# EAGLE design DS2482-LC24XX-breakout (EAGLE 6.3)
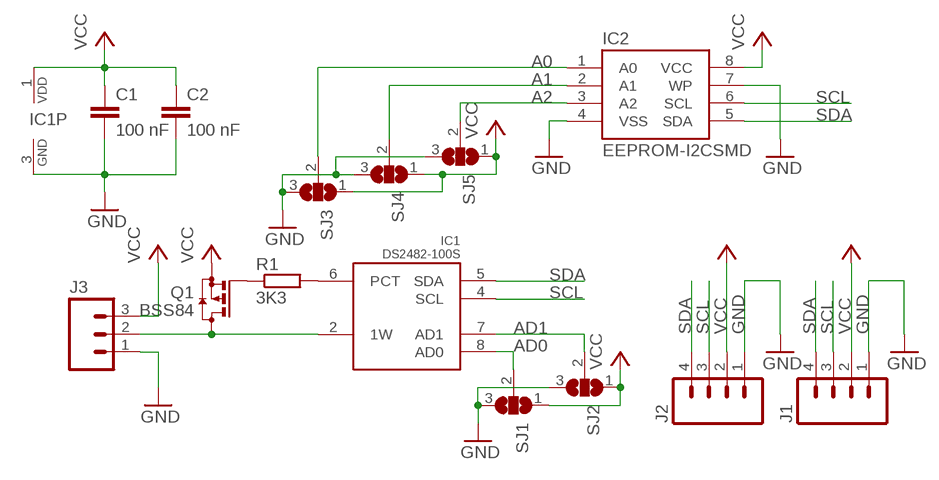
[diagram p0: schematic, sheet 1]

## Parts
C1  100 nF  C-EUC0603  [C0603]
C2  100 nF  C-EUC0603  [C0603]
IC1  DS2482-100S  [SO08]
IC2  EEPROM-I2CSMD  [SO08]
J1  M04PTH  [1X04]
J2  M04PTH  [1X04]
J3  M03PTH  [1X03]
Q1  BSS84  [SOT23]
R1  3K3  R-EU_R0805  [R0805]
SJ1  SJ2W  [SJ_2]
SJ2  SJ2W  [SJ_2]
SJ3  SJ2W  [SJ_2]
SJ4  SJ2W  [SJ_2]
SJ5  SJ2W  [SJ_2]

## Nets
A0: IC2.1(A0) SJ3.2
A1: IC2.2(A1) SJ4.2
A2: IC2.3(A2) SJ5.2
AD0: IC1.8(AD0) SJ1.2
AD1: IC1.7(AD1) SJ2.2
GND: C1.2 C2.2 IC1.3(GND) IC2.4(VSS) IC2.7(WP) J1.1 J2.1 J3.1 SJ1.3 SJ2.3 SJ3.3 SJ4.3 SJ5.3
N$1: IC1.2(1W) J3.2 Q1.3(D)
N$7: IC1.6(PCT) R1.2
N$8: Q1.1(G) R1.1
SCL: IC1.4(SCL) IC2.6(SCL) J1.3 J2.3
SDA: IC1.5(SDA) IC2.5(SDA) J1.4 J2.4
VCC: C1.1 C2.1 IC1.1(VDD) IC2.8(VCC) J1.2 J2.2 J3.3 Q1.2(S) SJ1.1 SJ2.1 SJ3.1 SJ4.1 SJ5.1

## Library data of the parts
C1 C2 = rcl:C-EU: CAPACITOR, European symbol
IC1 = 1wire:DS2482-100: I2C to 1-Wire Host Adapter/Line Driver This device is a onewire host and I2C interface in one chip. It provides the complete DC/AC requirements for onewire communication, including overdrive speed mode, but, unlike the DS2480B chip, no 12V EPROM programming. Notes: For overdrive speed and 5V EEPROM programming, an external active pullup circuit must be connected to the 1W, VDD and PCT pin. See the datasheet for details. The lower two I2C adress bits of the chip can be selected by external pins, so up to 4 chips may be connected to the same I2C bus. Author: Orginal device and description from Giovanni Varasano <giovanni.varasano@fastwebnet.it> Improved by Jan Kandziora <jjj@gmx.de>
IC2 = SparkFun:EEPROM-I2C
J1 J2 = SparkFun:M04: Header 4 Standard 4-pin 0.1" header. Use with straight break away headers (SKU : PRT-00116), right angle break away headers (PRT-00553), swiss pins (PRT-00743), machine pins (PRT-00117), and female headers (PRT-00115). Molex polarized connector foot print use with SKU : PRT-08231 with associated crimp pins and housings. 1MM SMD Version SKU: PRT-10208
J3 = SparkFun:M03: Header 3 Standard 3-pin 0.1" header. Use with straight break away headers (SKU : PRT-00116), right angle break away headers (PRT-00553), swiss pins (PRT-00743), machine pins (PRT-00117), and female headers (PRT-00115). Molex polarized connector foot print use with SKU : PRT-08232 with associated crimp pins and housings.
Q1 = transistor-small-signal:BSS84: P-CHANNEL MOS FET
R1 = rcl:R-EU_: RESISTOR, European symbol
SJ1-SJ5 = jumper:SJ2W: SMD solder JUMPER

## Board
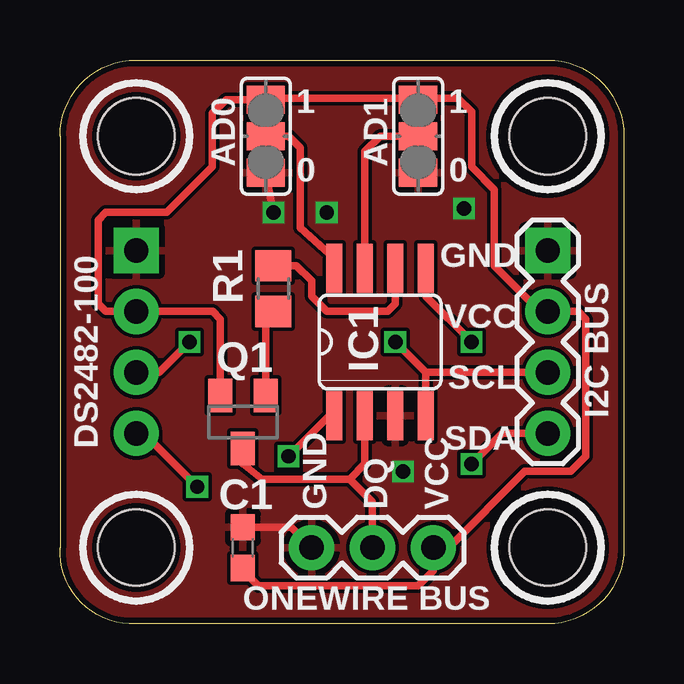
[diagram p1: board, top side]
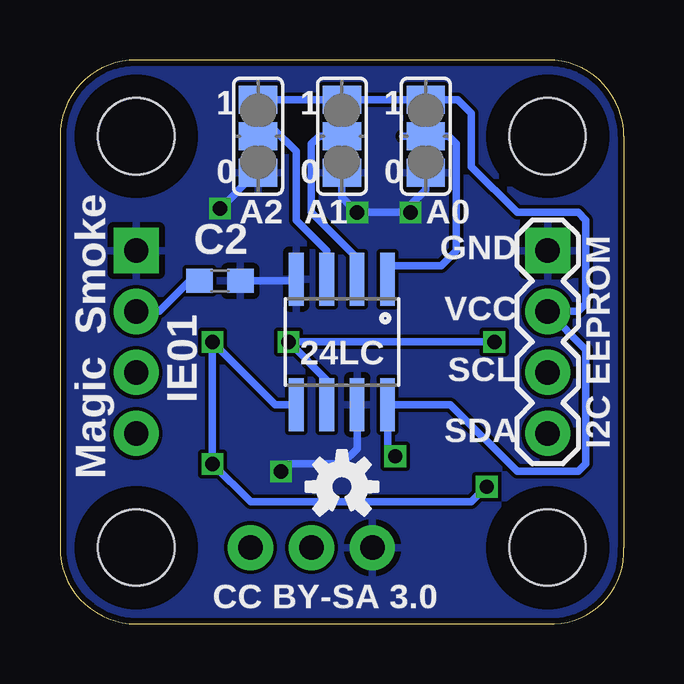
[diagram p2: board, bottom side, seen from below]

Size 23.5 x 23.5 mm. Coordinates in mm from the lower left corner, seen from the top.
Outline: 20.32,23.5 arc-90 23.5,20.32 23.5,3.18 arc-90 20.32,0 3.18,0 arc-96 0,3.18 0,20.32 arc-90 3.18,23.5 20.32,23.5
Copper layers (1*2*15*16): Top 0.035mm / dielectric 0.2mm / layer 2 0.0175mm / dielectric 1.1mm / layer 15 0.0175mm / dielectric 0.2mm / Bottom 0.035mm
Design rules "SeeedStudio_DRU_no_angle_20130527": minimum track width 6mil, minimum drill 12mil, track to track 6mil, track to pad 6mil, pad to pad 6mil, via to via 6mil, smd to smd 0mil, copper to edge 10mil, drill to drill 10mil, minimum pad ring 6mil, minimum via ring 6mil, stop-mask expansion 2mil, vias tented up to drill 25mil, thermal gap 10mil
Holes 3.17 mm at 20.32,3.18 20.32,20.32 3.18,3.18 3.18,20.32
tRestrict: area 17.8,17.8 to 22.9,22.9; area 17.8,0.6 to 22.9,5.7
bRestrict: area 17.8,17.8 to 22.9,22.9; area 17.8,0.6 to 22.9,5.7; area 0.6,0.6 to 5.7,5.7; area 0.6,17.8 to 5.7,22.9

### Footprints (pad centres in the part's own frame; a part is rotated, then mirrored left to right if it is on the bottom)
C0603 = smd 1.1 x 1: 1 -0.85,0; 2 0.85,0
SO08 = smd 0.66 x 2.032: 1 -1.905,-3.073; 2 -0.635,-3.073; 3 0.635,-3.073; 4 1.905,-3.073; 5 1.905,3.073; 6 0.635,3.073; 7 -0.635,3.073; 8 -1.905,3.073
SO08' = smd 0.61 x 2.21: 1 -1.905,-2.616; 2 -0.635,-2.616; 3 0.635,-2.616; 4 1.905,-2.616; 5 1.905,2.616; 6 0.635,2.616; 7 -0.635,2.616; 8 -1.905,2.616
1X04 = drill 1.016 pad 1.88 square: 1 0,0 | drill 1.016 pad 1.88: 2 2.54,0; 3 5.08,0; 4 7.62,0
1X03 = drill 1.016 pad 1.88: 1 0,0; 2 2.54,0; 3 5.08,0
SOT23 = smd 1 x 1.4: 1 -0.95,-1.1; 2 0.95,-1.1; 3 0,1.1
R0805 = smd 1.3 x 1.5: 1 -0.95,0; 2 0.95,0
SJ_2 = smd 1.168 x 1.6: 1 -1.524,0; 2 0,0; 3 1.524,0

### Placement (x,y rotation side)
C1  7.62,3.18 90 top
C2  16.83,14.29 0 bottom
IC1  13.34,11.75 0 top
IC2  EEPROM-I2CSMD  [SO08']  11.75,11.75 180 bottom
J1  20.32,15.56 270 top
J2  3.18,15.56 270 bottom
J3  10.48,3.18 0 top
Q1  7.62,8.42 180 top
R1  8.89,13.97 90 top
SJ1  8.57,20.32 270 top
SJ2  14.92,20.32 270 top
SJ3  8.26,20.32 270 bottom
SJ4  11.75,20.32 270 bottom
SJ5  15.24,20.32 270 bottom
U$3  [OSHW-LOGO-S]  11.75,5.72 0 bottom

### Tracks (layer width: path | path; a pad name or v marks a point on that pad's centre or on a via)
A0
  Bottom 0.305: 9.21,20.32 SJ3.2 7.3,20.32 6.99,20 6.99,15.56 7.62,14.92 9.84,14.92 IC2.1
A1
  Bottom 0.305: SJ4.2 12.7,20.32 13.02,20 13.02,17.15 11.11,15.24 IC2.2
A2
  Bottom 0.305: IC2.3 12.38,15.56 13.65,16.83 13.65,19.69 14.61,20.64 15.24,20.64 SJ5.2
AD0
  Top 0.305: SJ1.2 9.53,20.32 10,19.85 10,16.51 11.43,15.24 IC1.8
AD1
  Top 0.305: SJ2.2 13.34,20.32 12.7,19.69 IC1.7
GND  (via drill 0.6)
  Top 0.305: C1.2 9.63,4.03 J3.1 | SJ1.3 v8.89,17.15
  Bottom 0.305: C2.2 13.73,14.29 IC2.4 | IC2.7 11.11,7.3 11.75,6.67 13.97,6.67 v14.29,6.35 | SJ4.3 11.75,17.78 v11.11,17.15 9.21,17.15 9.05,17.31 | SJ3.3 8.26,18.1 9.05,17.31 | SJ5.3 15.4,18.73 v16.83,17.31 | v8.89,17.15 9.05,17.31
  pour Top: -0.63,24.13 24.13,24.13 24.13,-0.63 -0.63,-0.63
  pour Bottom: -0.95,-0.95 -0.95,24.45 24.45,24.45 24.45,-0.95
N$1
  Top 0.305: IC1.2 12.7,6.67 12.07,6.03 | 12.07,6.03 13.02,5.08 J3.2 | 12.07,6.03 8.43,6.03 7.62,6.67 Q1.3
N$7
  Top 0.305: IC1.6 13.97,13.34 13.65,13.02 11.11,13.02 10.48,13.65 10.48,14.29 9.84,14.92 R1.2
N$8
  Top 0.305: Q1.1 8.57,12.7 R1.1
SCL  (via drill 0.6)
  Top 0.305: 15.24,7.94 IC1.4 15.24,10.48 | J2.3 4.13,10.48 v5.4,11.75 | v13.97,11.75 15.24,10.48 | 15.24,10.48 J1.3
  Bottom 0.305: v5.4,11.75 v13.97,11.75 12.38,10.16 IC2.6
SDA  (via drill 0.6)
  Top 0.305: J1.4 18.42,7.94 v17.15,6.67 | v17.15,11.75 15.24,13.65 IC1.5 | J2.4 3.49,7.94 v5.72,5.72
  Bottom 0.305: v5.72,5.72 6.35,5.08 15.56,5.08 v17.15,6.67 v17.15,11.75 14.53,9.13 IC2.5
VCC  (via drill 0.6)
  Top 0.305: SJ1.1 7.88,21.85 | Q1.2 6.67,12.7 6.35,13.02 J2.2 1.91,13.02 1.59,13.34 1.59,16.83 1.91,17.15 4.45,17.15 6.35,19.05 6.35,21.27 6.92,21.85 SJ1.1 | C1.1 7.62,2.22 8.26,1.59 14.92,1.59 15.56,2.22 J3.3 16.19,3.18 19.37,6.35 21.27,6.35 21.91,6.99 21.91,12.7 21.59,13.02 J1.2 19.69,13.02 19.69,13.34 18.1,14.92 18.1,18.1 17.15,19.05 17.15,21.34 16.57,21.91 14.99,21.91 | 14.99,21.91 SJ2.1 | 14.99,21.91 8.64,21.91 SJ1.1 | IC1.1 11.22,8.68 v9.53,6.99
  Bottom 0.305: J1.2 19.37,13.02 18.1,14.29 C2.1 17.78,14.39 | 11.81,21.85 11.75,21.91 | SJ4.1 11.49,21.85 | 15.56,21.91 SJ5.1 11.81,21.85 | SJ4.1 SJ3.1 6.92,21.85 6.35,21.27 6.35,19.05 4.45,17.15 1.91,17.15 1.59,16.83 1.59,13.34 1.91,13.02 J2.2 1.59,11.43 1.59,6.67 1.91,6.35 4.45,6.35 7.23,9.13 IC2.8 9.84,7.3 v9.53,6.99 | 11.81,21.85 SJ4.1

### Text on the board
tPlace: 1 | 1 | AD0 | AD1 | 0 | 0 | GND | VCC | SCL | I2C BUS | SDA | DS2482-100 | GND | DQ | VCC | ONEWIRE BUS
bPlace: 1 | 1 | 1 | 0 | 0 | 0 | A0 | A1 | A2 | I2C EEPROM | GND | VCC | Smoke | SCL | 24LC | SDA | IE01 | Magic | CC BY-SA 3.0